# Altium schematic sheet Heracles Headers.SchDoc: Heracles Headers
size Letter; Author: Nicholas J. Sorensen; Engineer: Nicholas J. Sorensen; DocumentNumber: 2; SheetNumber: 2; SheetTotal: 4
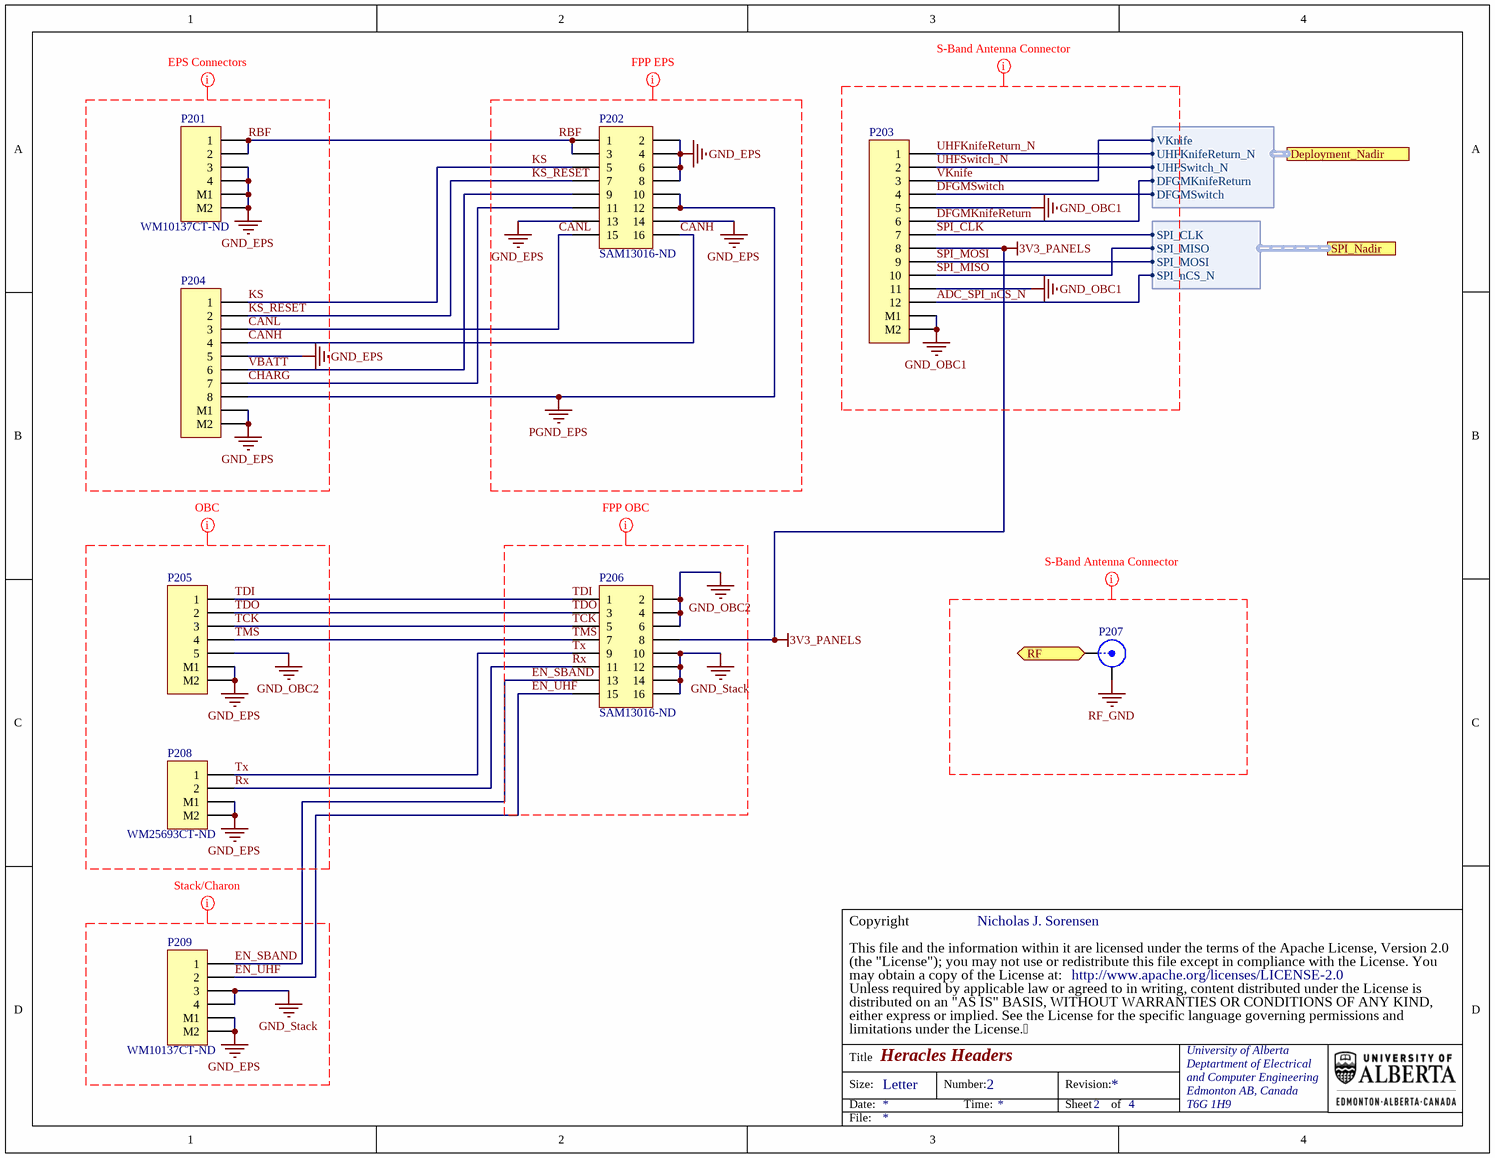
[diagram p0: Heracles Headers.SchDoc]

## Parts
P201  WM10137CT-ND  [MOLX-5040500491]
P202  SAM13016-ND  [TSS-108-01-G-D]
P203  PICOLOCK 12  [MOLX-5040501291]  (value not drawn)
P204  WM14421CT-ND  [MOLX-5040500891]  (value not drawn)
P205  PICOLOCK 5  [MOLX-5040500591]  (value not drawn)
P206  SAM13016-ND  [TSS-108-01-G-D]
P207  J10399-ND  [J10399-ND]  (value not drawn)
P208  WM25693CT-ND  [MOLX-5040500291]
P209  WM10137CT-ND  [MOLX-5040500491]

## Ports
Deployment_Nadir (harness Deployment_Nadir), RF (bidir), SPI_Nadir (harness SPI_Nadir)

## Harnesses
Deployment_Nadir: UHFSwitch_N, UHFKnifeReturn_N, VKnife, DFGMKnifeReturn, DFGMSwitch
SPI_Nadir: SPI_CLK, SPI_MISO, SPI_MOSI, SPI_nCS_N

## Nets
3V3_PANELS: P203.8 P206.8
GND_EPS: P201.3 P201.4 P201.M1 P201.M2 P202.2 P202.4 P202.6 P202.8 P202.13 P202.14 P204.5 P204.M1 P204.M2 P205.M1 P205.M2 P208.M1 P208.M2 P209.M1 P209.M2
GND_OBC1: P203.5 P203.11 P203.M1 P203.M2
GND_OBC2: P205.5 P206.2 P206.4 P206.6
GND_Stack: P206.10 P206.12 P206.14 P206.16 P209.3 P209.4
PGND_EPS: P202.10 P202.12 P204.8
RF_GND: P207.2(Y)
ADC_SPI_nCS_N: P203.12 ; port SPI_Nadir.SPI_nCS_N
CANH: P202.16 P204.4
CANL: P202.15 P204.3
CHARG: P202.11 P204.7
DFGMKnifeReturn: P203.6 ; port Deployment_Nadir.DFGMKnifeReturn
DFGMSwitch: P203.4 ; port Deployment_Nadir.DFGMSwitch
EN_SBAND: P206.13 P209.1
EN_UHF: P206.15 P209.2
KS: P202.5 P204.1
KS_RESET: P202.7 P204.2
RBF: P201.1 P201.2 P202.1 P202.3
RF: P207.1(X) ; port RF
Rx: P206.11 P208.2
SPI_CLK: P203.7 ; port SPI_Nadir.SPI_CLK
SPI_MISO: P203.10 ; port SPI_Nadir.SPI_MISO
SPI_MOSI: P203.9 ; port SPI_Nadir.SPI_MOSI
TCK: P205.3 P206.5
TDI: P205.1 P206.1
TDO: P205.2 P206.3
TMS: P205.4 P206.7
Tx: P206.9 P208.1
UHFKnifeReturn_N: P203.1 ; port Deployment_Nadir.UHFKnifeReturn_N
UHFSwitch_N: P203.2 ; port Deployment_Nadir.UHFSwitch_N
VBATT: P202.9 P204.6
VKnife: P203.3 ; port Deployment_Nadir.VKnife

## Layout directives
mark named EPS Connectors: CANH, CANL, CHARG, GND_EPS, KS, KS_RESET, RBF, VBATT
mark named OBC: GND_EPS, GND_OBC2, Rx, TCK, TDI, TDO, TMS, Tx
mark named FPP EPS: CANH, CANL, GND_EPS, KS, KS_RESET, PGND_EPS, RBF
mark named FPP OBC: EN_SBAND, EN_UHF, GND_OBC2, GND_Stack, Rx, TCK, TDI, TDO, TMS, Tx
mark named Stack/Charon: EN_SBAND, EN_UHF, GND_EPS, GND_Stack
mark named S-Band Antenna Connector: 3V3_PANELS, ADC_SPI_nCS_N, DFGMKnifeReturn, DFGMSwitch, GND_OBC1, RF_GND, SPI_CLK, SPI_MISO, SPI_MOSI, UHFKnifeReturn_N, UHFSwitch_N, VKnife

## Notes on the sheet
- (the "License"); you may not use or redistribute this file except in compliance with the License. You
- This file and the information within it are licensed under the terms of the Apache License, Version 2.0
- Copyright
- Unless required by applicable law or agreed to in writing, content distributed under the License is
- distributed on an "AS IS" BASIS, WITHOUT WARRANTIES OR CONDITIONS OF ANY KIND,
- either express or implied. See the License for the specific language governing permissions and
- limitations under the License.
- may obtain a copy of the License at:
- http://www.apache.org/licenses/LICENSE-2.0
- Title
- Size:
- Date:
- Letter
- Number:
- Time:
- Revision:
- Sheet
- of
- University of Alberta
- Deptartment of Electrical
- and Computer Engineering
- Edmonton AB, Canada
- T6G 1H9
- File:

## Library data of the parts
P201 P209 = 63: CONN HEADER SMD R/A 4POS 1.5MM; Part Number: 63; Manufacturer Part Number: 5040500491; Designator: P?; LatestRevisionDate: 17-Jul-2002; LatestRevisionNote: Re-released for DXP Platform.; Publisher: Altium Limited; Supplier Part Number 1: WM10137CT-ND; Supplier 1: Digi-Key; Supplier Link: #https://www.digikey.ca/product-detail/en/molex/5040500491/WM10137CT-ND/4357653#
P202 P206 = PP-SAM-00007: CONN HEADER VERT 16POS 2.54MM; Index: 8; LatestRevisionDate: 7/1/2020; LatestRevisionNote: ...; Publisher: AlbertaSat; Part Number: PP-SAM-00007; Manufacturer Part Number: TSS-108-01-G-D; Supplier Part Number 1: SAM13016-ND; Supplier 1: Digi-key; Published: 7/1/2020; Supplier Link: #https://www.digikey.ca/en/products/detail/samtec-inc/TSS-108-01-G-D/2345166#
P203 = 71: CONN HEADER SMD R/A 12POS 1.5MM; Part Number: 71; Manufacturer Part Number: 5040501291; Designator: P?; LatestRevisionDate: 17-Jul-2002; LatestRevisionNote: Re-released for DXP Platform.; Publisher: Altium Limited; Supplier Part Number 1: WM16219CT-ND; Supplier 1: Digi-Key; Supplier Link: #https://www.digikey.ca/product-detail/en/molex/5040501291/WM16219CT-ND/6702294#
P204 = 67: CONN HEADER SMD R/A 8POS 1.5MM; Part Number: 67; Manufacturer Part Number: 5040500891; Designator: P?; LatestRevisionDate: 17-Jul-2002; LatestRevisionNote: Re-released for DXP Platform.; Publisher: Altium Limited; Supplier Part Number 1: WM14421CT-ND; Supplier 1: Digi-Key; Supplier Link: #https://www.digikey.ca/product-detail/en/molex/5040500891/WM14421CT-ND/6133151#
P205 = 64: CONN HEADER SMD R/A 5POS 1.5MM; Part Number: 64; Manufacturer Part Number: 5040500591; Designator: P?; LatestRevisionDate: 17-Jul-2002; LatestRevisionNote: Re-released for DXP Platform.; Publisher: Altium Limited; Supplier Part Number 1: WM24877CT-ND; Supplier 1: Digi-Key; Supplier Link: https://www.digikey.ca/product-detail/en/molex/5040500591/WM24877CT-ND/9659635
P207 = P01-CIN-00000: CONN SMB PLUG R/A 50OHM PCB; Manufacturer Part Number: Cinch Connectivity Solutions Johnson; Index: 1; Designator: P?; LatestRevisionDate: 7/6/2020; LatestRevisionNote: ...; Publisher: AlbertaSat; Part Number: P01-CIN-00000; Supplier Part Number 1: J10399-ND; Supplier 1: Digi-key; Published: 7/6/2020; Supplier Link: #https://www.digikey.ca/en/products/detail/cinch-connectivity-solutions-johnson/131-1801-371/251419#
P208 = 61: CONN HEADER SMD R/A 2POS 1.5MM; Part Number: 61; Manufacturer Part Number: 5040500291; Designator: P?; LatestRevisionDate: 17-Jul-2002; LatestRevisionNote: Re-released for DXP Platform.; Publisher: Altium Limited; Supplier Part Number 1: WM25693CT-ND; Supplier 1: Digi-Key; Supplier Link: #https://www.digikey.ca/product-detail/en/molex/5040500291/WM25693CT-ND/9954119#